# EasyEDA Pro project can2clusterV2.epro

# Schematic can2clusterV3
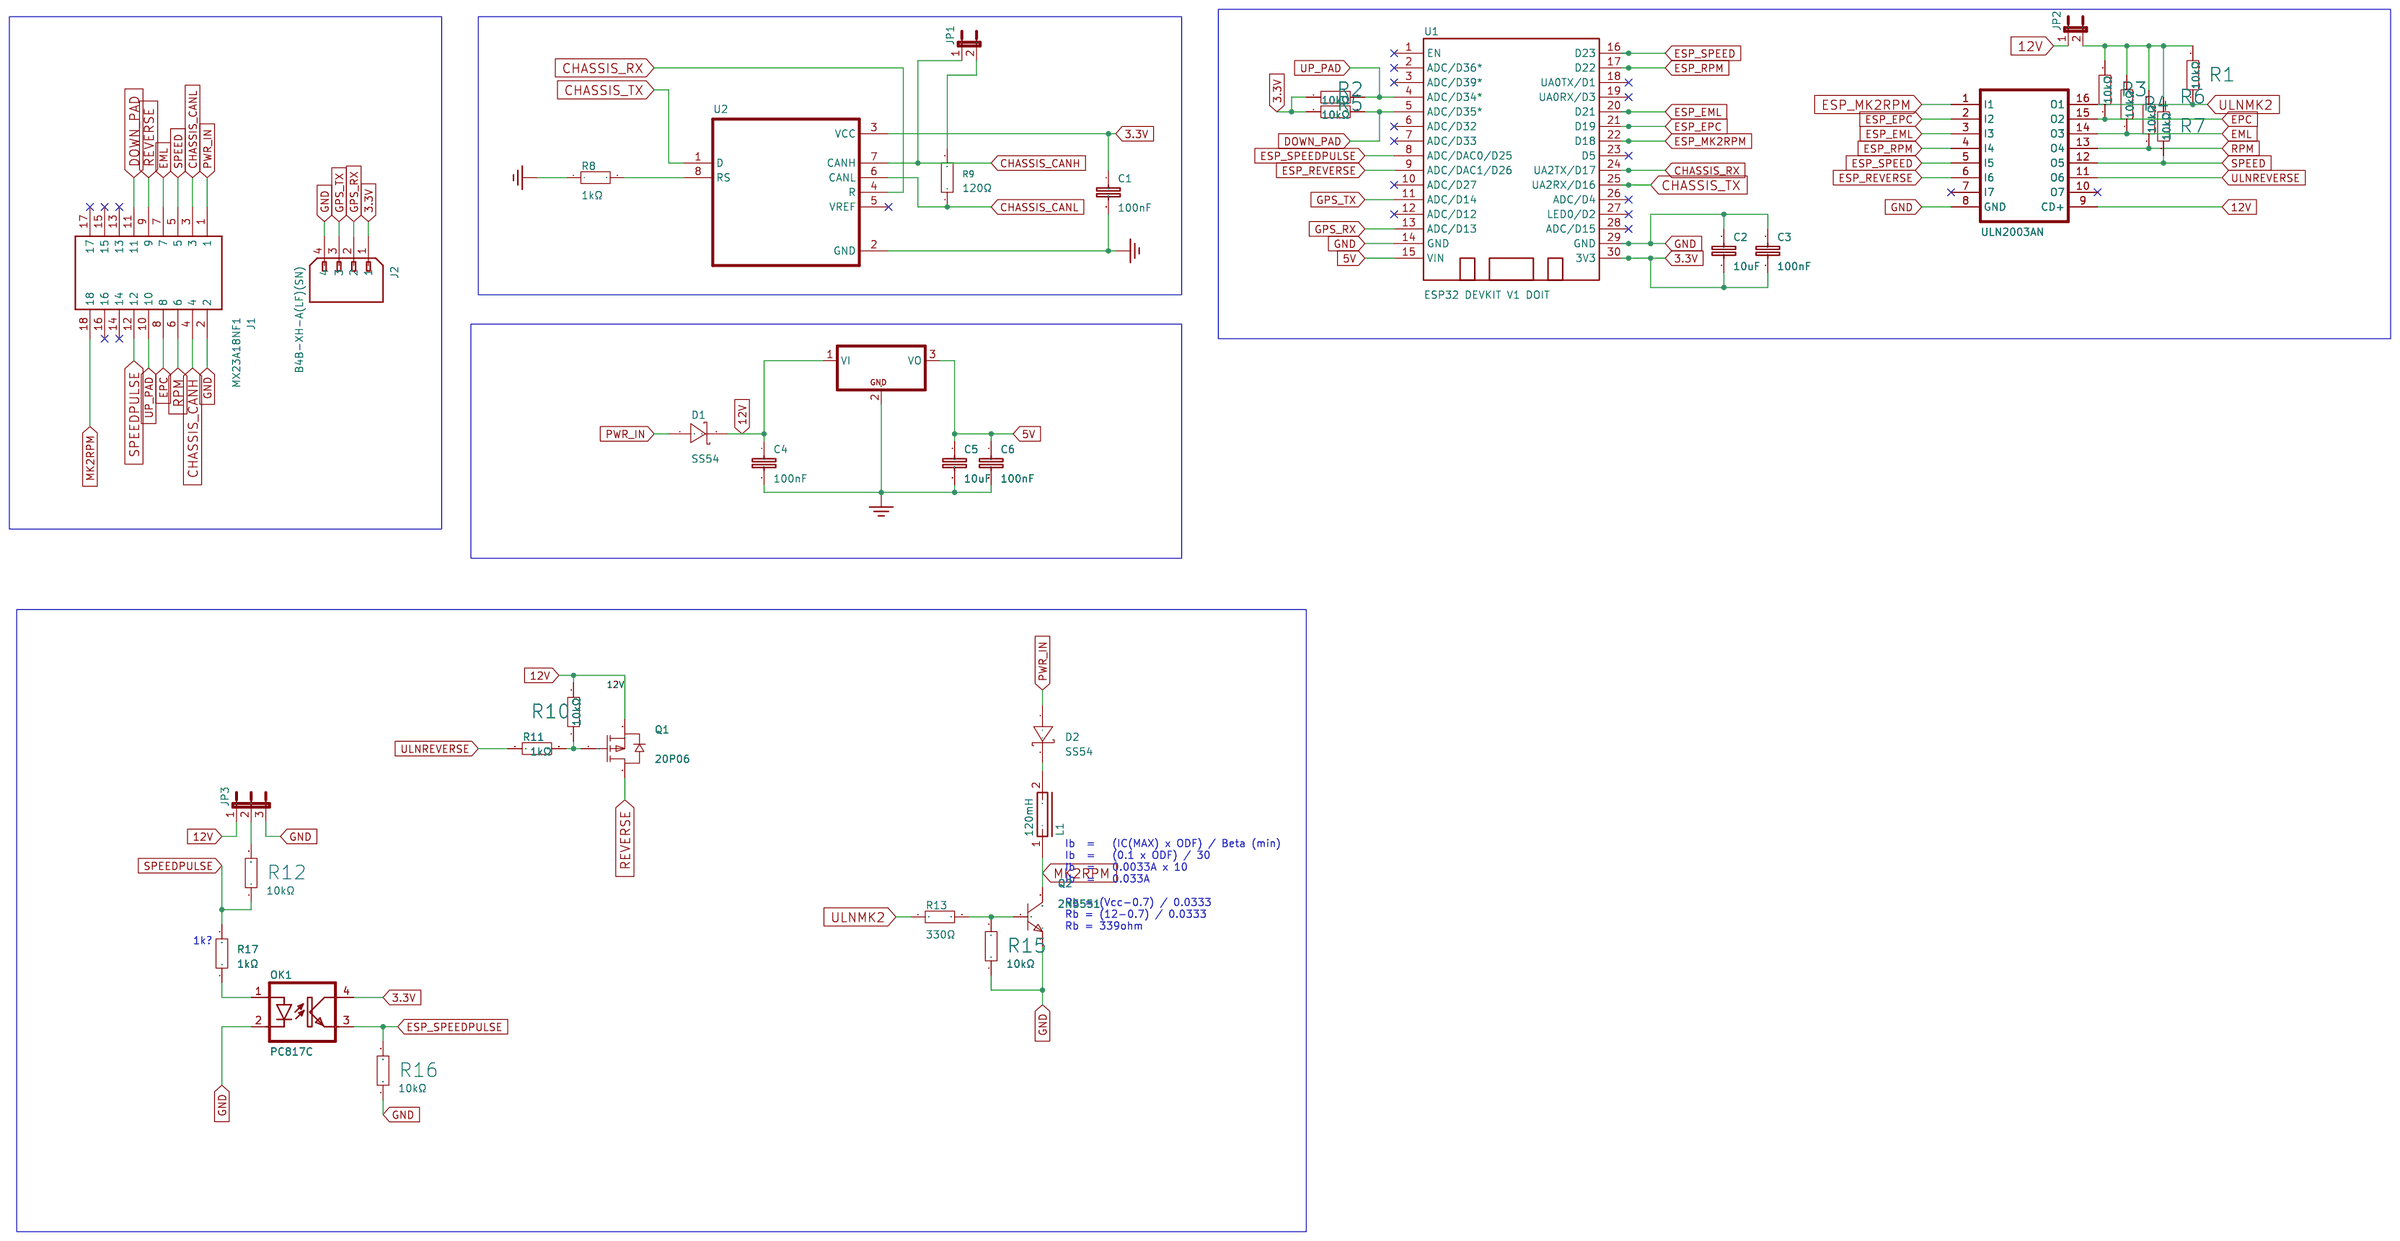
[diagram p0: schematic sheet]

## Parts
C1  100nF  [C0603]
C2  10uF  [C0805]
C3  100nF  [C0603]
C4  100nF  [C0603]
C5  10uF  [C0805]
C6  100nF  [C0603]
D1  SS54  [SMA_L4.4-W2.8-LS5.4-R-RD]
D2  SS54  [SMA_L4.4-W2.8-LS5.4-R-RD]
IC1  ULN2003AN  [DIP-16_L19.7-W6.6-P2.54-LS7.6-BL]
IC2  L7805ABD2T-TR  [TO-263-2_L10.0-W9.2-P5.08-LS15.3-TL-CW]
J1  MX23A18NF1  [CONN-TH_18P-P2.50_MX23A18NF1]
J2  B4B-XH-A(LF)(SN)  [CONN-TH_B4B-XH-A-LF-SN]
JP1  PZ254V-11-02P  [HDR-TH_2P-P2.54-V-M]
JP2  PZ254V-11-02P  [HDR-TH_2P-P2.54-V-M]
JP3  PZ254V-11-03P  [HDR-TH_3P-P2.54-V-M]
L1  120mH  [IND-SMD_L12.5-W12.5]
OK1  PC817C  [OPTO-SMD-4_L4.6-W6.5-P2.54-LS10.3-TL]
Q1  20P06  [TO-252-2_L6.6-W6.1-P4.57-LS9.9-BR-CW]
Q2  2N5551  [SOT-23-3_L2.9-W1.4-P1.90-LS2.5-BR]
R1  10kΩ  [R0603]
R2  10kΩ  [R0603]
R3  10kΩ  [R0603]
R4  10kΩ  [R0603]
R5  10kΩ  [R0603]
R6  10kΩ  [R0603]
R7  10kΩ  [R0603]
R8  1kΩ  [R0603]
R9  120Ω  [R0603]
R10  10kΩ  [R0603]
R11  1kΩ  [R0603]
R12  10kΩ  [R0603]
R13  330Ω  [R0603]
R15  10kΩ  [R0603]
R16  10kΩ  [R0603]
R17  1kΩ  [R0603]
U1  ESP32 DEVKIT V1 DOIT  [DOIT-ESP32-DEVKIT-V1]
U2  SN65HVD230DR  [SOIC-8_L4.9-W3.9-P1.27-LS6.0-BL]

## Library data of the parts
C1 C3 C4 C6 = CC0603KRX7R9BB104: Capacitance:100nF Tolerance:±10% Tolerance:±10% Voltage Rating:50V Temperature Coefficient:X7R; LCSC Part Name: 100nF ±10% 50V; Supplier Part: C14663; Manufacturer: YAGEO(国巨); Supplier Footprint: 0603; JLCPCB Part Class: Basic Part; Datasheet: https://atta.szlcsc.com/upload/public/pdf/source/20250214/096C4C206003071F5D32E5F0D8E7F8DF.pdf; Supplier: LCSC; Tolerance: ±10%; Voltage Rating: 50V; Temperature Coefficient: X7R
C2 C5 = CL21A106KAYNNNE_C15850: Capacitance: Tolerance:±10% Tolerance:±10% Voltage Rated: Temperature Coefficient:; LCSC Part Name: 10uF ±10% 25V; Supplier Part: C15850; Manufacturer: SAMSUNG(三星); Manufacturer Part: CL21A106KAYNNNE; Supplier Footprint: 0805; JLCPCB Part Class: Basic Part; Datasheet: https://atta.szlcsc.com/upload/public/pdf/source/20160218/1457707763339.pdf; Supplier: LCSC; Tolerance: ±10%
D1 D2 = SS54_C22452: Diode Configuration:Independent Type Forward Voltage (Vf@If):550mV@5A Reverse Voltage (Vr):40V Rectified Current:5A Reverse Leakage Current (Ir):1mA@40V; LCSC Part Name: 电压:40V 电流:5A; Supplier Part: C22452; Manufacturer: MDD(辰达半导体); Supplier Footprint: SMA(DO-214AC); JLCPCB Part Class: Basic Part; Datasheet: https://atta.szlcsc.com/upload/public/pdf/source/20240710/73DFBB65C1883B895E62D589679033DF.pdf; Supplier: LCSC; Diode Configuration: Independent Type; Forward Voltage (Vf@If): 550mV@5A; Reverse Voltage (Vr): 40V; Rectified Current: 5A; Reverse Leakage Current (Ir): 1mA@40V
IC1 = ULN2003AN_C7432319: Supplier Part: C7432319; Manufacturer: HGSEMI(华冠); Supplier Footprint: DIP-16; JLCPCB Part Class: Extended Part; Datasheet: https://atta.szlcsc.com/upload/public/pdf/source/20230912/E2292EB18F082A67756D9BB26BF00C82.pdf; Supplier: LCSC
IC2 = L7805ABD2T-TR: Output Type:Fixed Maximum Input Voltage:35V Output Voltage:5V Output Voltage:5V Output Current:1.5A Power Supply Rejection Ratio (PSRR):68dB@(120Hz) Dropout Voltage:2V@(1A) standby current:6mA Feature:Short-Circuit  Protection；Thermal Protection(TSD) Oper; LCSC Part Name: 正稳压器IC; Supplier Part: C86206; Manufacturer: ST(意法半导体); Supplier Footprint: TO-263-2; JLCPCB Part Class: Extended Part; Datasheet: https://atta.szlcsc.com/upload/public/pdf/source/20191219/C472632_C0855675BBC73B8C8E44EE1325AAD56A.pdf; Supplier: LCSC; Output Type: Fixed; Maximum Input Voltage: 35V; Output Voltage: 5V; Output Current: 1.5A; Power Supply Rejection Ratio (PSRR): 68dB@(120Hz); Dropout Voltage: 2V@(1A); standby current: 6mA; Feature: Short-Circuit  Protection；Thermal Protection(TSD); Operating Temperature: -40℃~+125℃; Output Polarity: Positive electrode; Number of Outputs: 1
J1 = MX23A18NF1: Supplier Part: C2977290; Manufacturer: JAE(日本航空电子); JLCPCB Part Class: Extended Part; Supplier: LCSC
J2 = B4B-XH-A(LF)(SN): Pins Structure:1x4P Pitch:2.5mm Mounting Style:Direct Insert Reference Series:XH Number of Pins:4P Number of Rows:1 Number of PINs Per Row:4 Row Spacing:- Current Rating (Max):3A Contact Material:Brass Contact Plating:Tin Operating Temperature Range:-25℃~; LCSC Part Name: 1x4P 间距:2.5mm 直插 系列:XH; Supplier Part: C144395; Manufacturer: JST; Supplier Footprint: 插件,P=2.5mm; JLCPCB Part Class: Extended Part; Datasheet: https://atta.szlcsc.com/upload/public/pdf/source/20180928/C265283_F9DFEEBDB2CF642B6BDFAB4B77BD2680.pdf; Supplier: LCSC; Pins Structure: 1x4P; Pitch: 2.5mm; Mounting Style: Direct Insert; Reference Series: XH; Number of Pins: 4P; Number of Rows: 1; Number of PINs Per Row: 4; Current Rating (Max): 3A; Contact Material: Brass; Contact Plating: Tin; Operating Temperature Range: -25℃~+85℃; Rated Voltage (Max): 250V; Plastic Material: PA66; Flame Retardant Rating: UL94V-0; Supplementary Features: K-leg punch; Colour: White; Z-Height of the Board: 7mm; X-Length of Bottom Edge on Board (Spacing Line): 12.4mm; Y-Width of Bottom Edge on Board: 5.75mm
JP1 JP2 = PZ254V-11-02P: Pin Structure:1x2P Pitch:2.54mm Row Spacing:- Circluar Pins/Square Pins:Policy Mounting Type:Straight Number of Rows:Single Row Number of Pins:2P Current Rating:- Voltage Rating (Max):- Length of Mating Pin:6mm Insulation Height:2.5mm Length of End Connec; LCSC Part Name: 1x2P 间距:2.54mm 方针 直插; Supplier Part: C492401; Manufacturer: XFCN(兴飞); Supplier Footprint: 插件,P=2.54mm; JLCPCB Part Class: Extended Part; Datasheet: https://atta.szlcsc.com/upload/public/pdf/source/20200309/C492401_A812433581A9B211A7FFA413ADDFF0E5.pdf; Supplier: LCSC; Pin Structure: 1x2P; Pitch: 2.54mm; Circluar Pins/Square Pins: Policy; Mounting Type: Straight; Number of Rows: Single Row; Number of Pins: 2P; Length of Mating Pin: 6mm; Insulation Height: 2.5mm; Length of End Connection Pin: 3mm; Contact Material: Brass; Operating Temperature: -40℃~+105℃; Color: Black
JP3 = PZ254V-11-03P: Pin Structure:1x3P Pitch:2.54mm Row Spacing:- Circluar Pins/Square Pins:Policy Mounting Type:Straight Number of Rows:Single Row Number of Pins:3P Current Rating:3A Voltage Rating (Max):250V Length of Mating Pin:6mm Insulation Height:2.5mm Length of End Co; LCSC Part Name: 1x3P 间距:2.54mm 方针 直插; Supplier Part: C2937625; Manufacturer: XFCN(兴飞); Supplier Footprint: 插件,P=2.54mm; JLCPCB Part Class: Extended Part; Datasheet: https://atta.szlcsc.com/upload/public/pdf/source/20200309/C492402_8335C3D49C4E4C618838D59BB1D024C1.pdf; Supplier: LCSC; Pin Structure: 1x3P; Pitch: 2.54mm; Circluar Pins/Square Pins: Policy; Mounting Type: Straight; Number of Rows: Single Row; Number of Pins: 3P; Current Rating: 3A; Voltage Rating (Max): 250V; Length of Mating Pin: 6mm; Insulation Height: 2.5mm; Length of End Connection Pin: 3mm; Operating Temperature: -40℃~+105℃; Color: Black
L1 = DR125-124-R: Inductance:120mH Tolerance:±20% Tolerance:±20% Current Rating:60mA Current - Saturation(Isat):69mA DC Resistance(DCR):150Ω Type:- Ratings:-; LCSC Part Name: 120mH ±20% 69mA; Supplier Part: C2453120; Manufacturer: EATON(伊顿); Supplier Footprint: SMD,12.5x12.5mm; JLCPCB Part Class: Extended Part; Datasheet: https://atta.szlcsc.com/upload/public/pdf/source/20210417/1890D5F29C45E96B4D8E6D27BBAB5A55.pdf; Supplier: LCSC; Tolerance: ±20%; Current Rating: 60mA; Current - Saturation(Isat): 69mA; DC Resistance(DCR): 150Ω
OK1 = PC817C_C3025164: Input voltage type:DC Output Type:Phototransistor Voltage - Forward(Vf):1.2V Output Current:50mA Isolation Voltage(Vrms):5kV Reverse Voltage:6V Load Voltage:35V Number of Outputs:1 Vce Saturation(VCE(sat)):100mV@1mA,20mA Rise time:6us@2mA,100Ω Fall time:5; LCSC Part Name: C档 PC817C C档; Supplier Part: C3025164; Manufacturer: GOODWORK(固得沃克); Supplier Footprint: SMD-4P; JLCPCB Part Class: Extended Part; Datasheet: https://atta.szlcsc.com/upload/public/pdf/source/20240617/7F1B42AFA4D9649DF13B74B1E0B1F256.pdf; Supplier: LCSC; Input voltage type: DC; Output Type: Phototransistor; Voltage - Forward(Vf): 1.2V; Output Current: 50mA; Isolation Voltage(Vrms): 5kV; Reverse Voltage: 6V; Load Voltage: 35V; Number of Outputs: 1; Vce Saturation(VCE(sat)): 100mV@1mA,20mA; Rise time: 6us@2mA,100Ω; Fall time: 5us@2mA,100Ω; Operating Temperature: -55℃~+110℃; Current Transfer Ratio (CTR) Minimum: 200%; Current Transfer Ratio (CTR) Maximum/Saturation Value: 400%
Q1 = 20P06: Type:1 Piece P-Channel Drain Source Voltage (Vdss):60V Continuous Drain Current (Id): Drain Source On Resistance (RDS(on)@Vgs,Id):48mΩ Gate Threshold Voltage (Vgs(th)@Id):2.5V; LCSC Part Name: 1个P沟道 耐压:60V 电流:20A; Supplier Part: C18164394; Manufacturer: HL(富海微); Supplier Footprint: TO-252; JLCPCB Part Class: Extended Part; Datasheet: https://atta.szlcsc.com/upload/public/pdf/source/20231012/DDB4F5E9C77D3DD288E1321309E3ABAC.pdf; Supplier: LCSC; Type: 1 Piece P-Channel; Drain Source Voltage (Vdss): 60V; Drain Source On Resistance (RDS(on)@Vgs,Id): 48mΩ; Gate Threshold Voltage (Vgs(th)@Id): 2.5V
Q2 = 2N5551_C7529570: Transistor Type: Collector Current (Ic): Collector-Emitter Breakdown Voltage (Vceo): Power Dissipation (Pd):625mW DC Current Gain (hFE@Ic,Vce):80@10mA,5V DC Current Gain (hFE@Ic,Vce):80@10mA,5V Transition Frequency (fT):80MHz Collector Cut-Off Current (Ic; LCSC Part Name: NPN 电流:1A 耐压:160V; Supplier Part: C7529570; Manufacturer: RUILON(瑞隆源); Supplier Footprint: SOT-23; JLCPCB Part Class: Extended Part; Datasheet: https://atta.szlcsc.com/upload/public/pdf/source/20231206/D621ADD1802AEB70BE68282CC20D67DB.pdf; Supplier: LCSC; Power Dissipation (Pd): 625mW; DC Current Gain (hFE@Ic,Vce): 80@10mA,5V; Transition Frequency (fT): 80MHz; Collector Cut-Off Current (Icbo): 100nA; Collector-Emitter Saturation Voltage (VCE(sat)@Ic,Ib): 500mV@50mA,5mA; Operating Temperature: -55℃~+150℃
R1-R7 R10 R12 R15 R16 = 0603WAF1002T5E: Type:Thick Film Resistor Resistance:10kΩ Tolerance:±1% Tolerance:±1% Power(Watts):100mW Voltage-Supply(Max):75V Temperature Coefficient:±100ppm/℃ Temperature Coefficient:±100ppm/℃ Operating Temperature:-55℃~+155℃ Operating Temperature:-55℃~+155℃; LCSC Part Name: 厚膜电阻 10kΩ ±1% 100mW; Supplier Part: C25804; Manufacturer: UNI-ROYAL(厚声); Supplier Footprint: 0603; JLCPCB Part Class: Basic Part; Datasheet: https://atta.szlcsc.com/upload/public/pdf/source/20200306/C422600_1E6D84923E4A46A82E41ADD87F860B5C.pdf; Supplier: LCSC; Type: Thick Film Resistor; Tolerance: ±1%; Power(Watts): 100mW; Voltage-Supply(Max): 75V; Temperature Coefficient: ±100ppm/℃; Operating Temperature: -55℃~+155℃
R8 R11 R17 = 0603WAF1001T5E: Type:Thick Film Resistors Resistance:1kΩ Tolerance:±1% Tolerance:±1% Power(Watts): Overload Voltage (Max): Temperature Coefficient:±100ppm/℃ Temperature Coefficient:±100ppm/℃ Operating Temperature Range:-55℃~+155℃ Operating Temperature Range:-55℃~+155℃; LCSC Part Name: 1kΩ ±1% 100mW 厚膜电阻; Supplier Part: C21190; Manufacturer: UNI-ROYAL(厚声); Supplier Footprint: 0603; JLCPCB Part Class: Basic Part; Datasheet: https://atta.szlcsc.com/upload/public/pdf/source/20200306/C422600_1E6D84923E4A46A82E41ADD87F860B5C.pdf; Supplier: LCSC; Type: Thick Film Resistors; Tolerance: ±1%; Temperature Coefficient: ±100ppm/℃; Operating Temperature Range: -55℃~+155℃
R9 = 0603WAF1200T5E: Type:Thick Film Resistors Resistance: Tolerance:±1% Tolerance:±1% Power(Watts): Overload Voltage (Max): Temperature Coefficient:±100ppm/℃ Temperature Coefficient:±100ppm/℃ Operating Temperature Range:-55℃~+155℃ Operating Temperature Range:-55℃~+155℃; LCSC Part Name: 120Ω ±1% 100mW 厚膜电阻; Supplier Part: C22787; Manufacturer: UNI-ROYAL(厚声); Supplier Footprint: 0603; JLCPCB Part Class: Basic Part; Datasheet: https://atta.szlcsc.com/upload/public/pdf/source/20200306/C422600_1E6D84923E4A46A82E41ADD87F860B5C.pdf; Supplier: LCSC; Type: Thick Film Resistors; Tolerance: ±1%; Temperature Coefficient: ±100ppm/℃; Operating Temperature Range: -55℃~+155℃
R13 = 0603WAF3300T5E: Type:Thick Film Resistors Resistance: Tolerance:±1% Tolerance:±1% Power(Watts): Overload Voltage (Max): Temperature Coefficient:±100ppm/℃ Temperature Coefficient:±100ppm/℃ Operating Temperature Range:-55℃~+155℃ Operating Temperature Range:-55℃~+155℃; LCSC Part Name: 330Ω ±1% 100mW 厚膜电阻; Supplier Part: C23138; Manufacturer: UNI-ROYAL(厚声); Supplier Footprint: 0603; JLCPCB Part Class: Basic Part; Datasheet: https://atta.szlcsc.com/upload/public/pdf/source/20200306/C422600_1E6D84923E4A46A82E41ADD87F860B5C.pdf; Supplier: LCSC; Type: Thick Film Resistors; Tolerance: ±1%; Temperature Coefficient: ±100ppm/℃; Operating Temperature Range: -55℃~+155℃
U1 = ESP32 DEVKIT V1 DOIT
U2 = SN65HVD230DR: Type:CANtransceiver Data Rate:1Mbps Voltage - Supply:- Voltage - Supply:- Current - Supply:- Operating Temperature:-40℃~+85℃ Operating Temperature:-40℃~+85℃; LCSC Part Name: 3.3-V CAN 收发器; Supplier Part: C12084; Manufacturer: TI(德州仪器); Supplier Footprint: SOIC-8; JLCPCB Part Class: Extended Part; Datasheet: https://www.ti.com/cn/lit/gpn/sn65hvd230; Supplier: LCSC; Type: CANtransceiver; Data Rate: 1Mbps; Operating Temperature: -40℃~+85℃

## Nets
3.3V: C1.1 C2.2 C3.2 J2.1 OK1.4(COL) R2.1 R5.1 U1.30(3V3) U2.3(VCC)
5V: C5.1 C6.1 IC2.3(VO) U1.15(VIN)
12V: C4.1 D1.2(K) IC1.9(CD+) IC2.1(VI) JP2.1 JP3.1 Q1.3(S) R10.2
GND: C1.2 C2.1 C3.1 C4.2 C5.2 C6.2 IC1.8(GND) IC2.2(GND) J1.2 J2.4 JP3.3 OK1.2(C) Q2.2(E) R8.1 R15.1 R16.1 U1.14(GND) U1.29(GND) U2.2(GND)
CHASSIS_CANH: J1.4 JP1.1 U2.7(CANH)
CHASSIS_CANL: J1.3 R9.1 U2.6(CANL)
CHASSIS_RX: U1.24(UA2TX/D17) U2.4(R)
CHASSIS_TX: U1.25(UA2RX/D16) U2.1(D)
DOWN_PAD: J1.11 R5.2 U1.5(ADC/D35*)
EML: IC1.14(O3) J1.7 R4.1
EPC: IC1.15(O2) J1.8 R3.1
ESP_EML: IC1.3(I3) U1.20(D21)
ESP_EPC: IC1.2(I2) U1.21(D19)
ESP_MK2RPM: IC1.1(I1) U1.22(D18)
ESP_REVERSE: IC1.6(I6) U1.9(ADC/DAC1/D26)
ESP_RPM: IC1.4(I4) U1.17(D22)
ESP_SPEED: IC1.5(I5) U1.16(D23)
ESP_SPEEDPULSE: OK1.3(EMIT) R16.2 U1.8(ADC/DAC0/D25)
GPS_RX: J2.2 U1.13(ADC/D13)
GPS_TX: J2.3 U1.11(ADC/D14)
MK2RPM: J1.18 L1.1 Q2.3(C)
N$1: D2.2(K) L1.2
N$5: R8.2 U2.8(RS)
N$8: JP1.2 R9.2
N$13: OK1.1(A) R17.1
N$14: JP3.2 R12.2
PWR_IN: D1.1(A) D2.1(A) J1.1
REVERSE: J1.9 Q1.2(D)
RPM: IC1.13(O4) J1.6 R6.1
SPEED: IC1.12(O5) J1.5 R7.1
SPEEDPULSE: J1.12 R12.1 R17.2
ULNMK2: IC1.16(O1) R1.1 R13.1
ULNREVERSE: IC1.11(O6) R11.1
UP_PAD: J1.10 R2.2 U1.4(ADC/D34*)
$1N6167: Q2.1(B) R13.2 R15.2
$1N7551: Q1.1(G) R10.1 R11.2
Net-(JP2-2): JP2.2 R1.2 R3.2 R4.2 R6.2 R7.2

Not connected (* = marked no-connect by the designer): IC1 7(I7)* 10(O7)*; J1 13* 14* 15* 16* 17*; U1 1(EN)* 2(ADC/D36*)* 3(ADC/D39*)* 6(ADC/D32)* 7(ADC/D33)* 10(ADC/D27)* 12(ADC/D12)* 18(UA0TX/D1)* 19(UA0RX/D3)* 23(D5)* 26(ADC/D4)* 27(LED0/D2)* 28(ADC/D15)*; U2 5(VREF)*

## Notes on the sheet
- Ib  =   (IC(MAX) x ODF) / Beta (min)
  Ib  =   (0.1 x ODF) / 30
  Ib  =   0.0033A x 10
  Ib  =   0.033A
  Rb = (Vcc-0.7) / 0.0333
  Rb = (12-0.7) / 0.0333
  Rb = 339ohm
- 1k?

# Board can2clusterV3
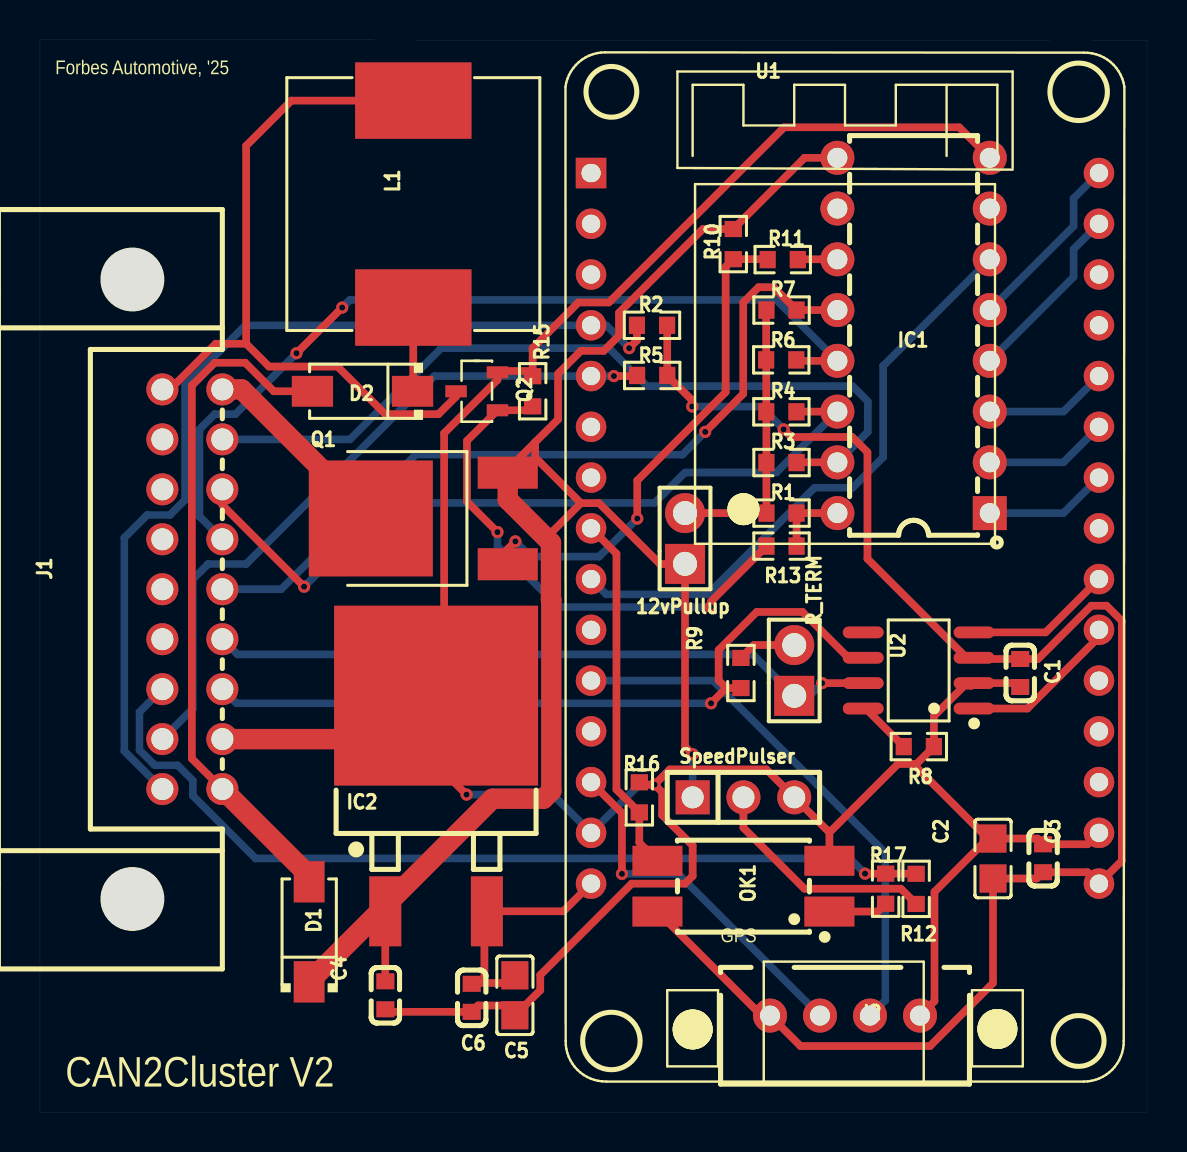
[diagram p1: board, top side]
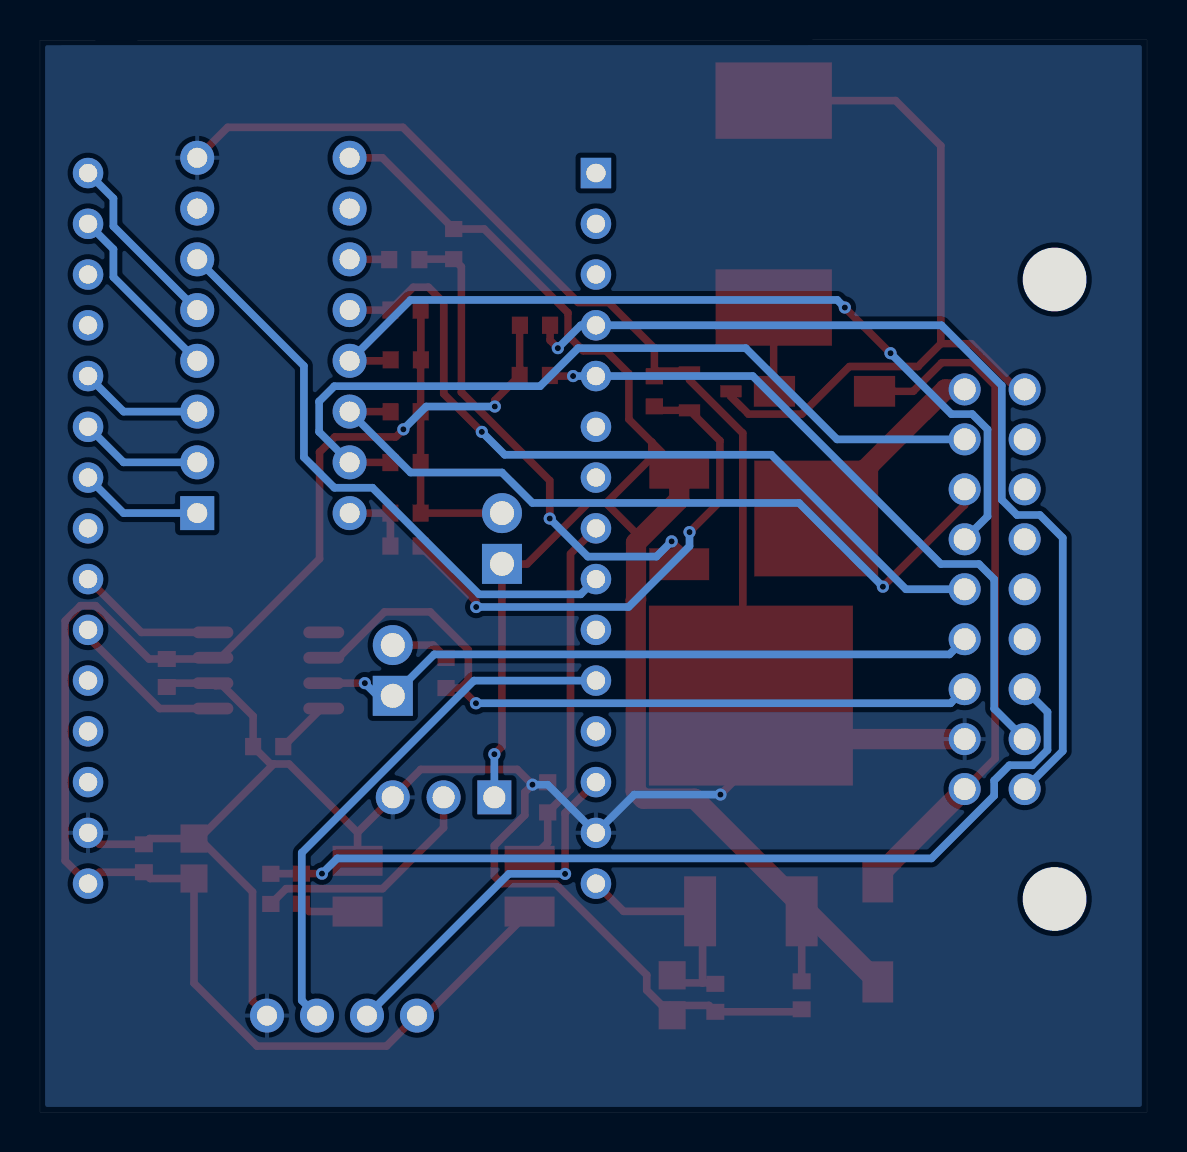
[diagram p2: board, bottom side, seen from below]

Outline 55.36 x 53.65 mm; copper layers: Top Layer, Bottom Layer. Coordinates in mm from the lower left corner of the outline.
Outline path: 0,53.65 0,0 55.36,0 55.36,53.64 0,53.65
Stack: Top Layer 0.035mm / Dielectric1 1.51mm FR4 er 4.5 / Bottom Layer 0.035mm

## Design rules (mm)
net CHASSIS_CANH: DP1
net CHASSIS_TX: DP2
net CHASSIS_CANL: DP1
net CHASSIS_RX: DP2
template: Custom Config
spacing copperThickness1oz (default): track to track 0.102, other pairs 0.152 to 0.3
spacing copperThickness2oz: track to track 0.203, other pairs 0.152 to 0.3
track width copperThickness1oz (default): min 0.203, default 0.381, max 2.54
track width copperThickness2oz: min 0.203, default 0.254, max 2.54
differential pair differentialPair (default): width min 0.127, default 0.254, max 2.54; gap min 0.152, default 0.152
via viaSize (default): diameter min 0.5, default 0.61, max 10; hole min 0.3, default 0.305, max 6.299
net 12V uses copperThickness2oz
net PWR_IN uses copperThickness2oz
net REVERSE uses copperThickness2oz

## Placement (name value [footprint] x y rotation side)
12vPullup  PZ254V-11-02P  [HDR-TH_2P-P2.54-V-M]  32.26 28.7 90 top
C1  100nF  [C0603]  49.02 21.97 270 top
C2  10uF  [C0805]  47.66 12.69 270 top
C3  100nF  [C0603]  50.16 12.7 270 top
C4  100nF  [C0603]  17.27 5.84 270 top
C5  10uF  [C0805]  23.75 5.84 270 top
C6  100nF  [C0603]  21.59 5.72 270 top
D1  SS54  [SMA_L4.4-W2.8-LS5.4-R-RD]  13.46 9.02 90 top
D2  SS54  [SMA_L4.4-W2.8-LS5.4-R-RD]  16.13 36.07 180 top
IC1  ULN2003AN  [DIP-16_L19.7-W6.6-P2.54-LS7.6-BL]  43.69 38.86 90 top
IC2  L7805ABD2T-TR  [TO-263-2_L10.0-W9.2-P5.08-LS15.3-TL-CW]  19.81 15.44 90 top
J1  MX23A18NF1  [CONN-TH_18P-P2.50_MX23A18NF1]  7.62 26.16 270 top
J2  B4B-XH-A(LF)(SN)  [CONN-TH_B4B-XH-A-LF-SN]  40.26 4.83 180 top
L1  120mH  [IND-SMD_L12.5-W12.5]  18.67 45.44 90 top
OK1  PC817C  [OPTO-SMD-4_L4.6-W6.5-P2.54-LS10.3-TL]  35.18 11.3 180 top
Q1  20P06  [TO-252-2_L6.6-W6.1-P4.57-LS9.9-BR-CW]  19.97 29.7 0 top
Q2  2N5551  [SOT-23-3_L2.9-W1.4-P1.90-LS2.5-BR]  21.84 36.07 0 top
R1  10kΩ  [R0603]  37.08 29.97 180 top
R2  10kΩ  [R0603]  30.61 39.37 180 top
R3  10kΩ  [R0603]  37.08 32.5 180 top
R4  10kΩ  [R0603]  37.08 35.04 180 top
R5  10kΩ  [R0603]  30.62 36.86 180 top
R6  10kΩ  [R0603]  37.07 37.64 180 top
R7  10kΩ  [R0603]  37.08 40.13 180 top
R8  1kΩ  [R0603]  43.95 18.29 180 top
R9  120Ω  [R0603]  35.05 21.97 90 top
R10  10kΩ  [R0603]  34.67 43.43 90 top
R11  1kΩ  [R0603]  37.14 42.66 180 top
R12  10kΩ  [R0603]  43.81 11.17 270 top
R13  330Ω  [R0603]  37.08 28.32 180 top
R15  10kΩ  [R0603]  24.64 36.07 270 top
R16  10kΩ  [R0603]  29.97 15.75 270 top
R17  1kΩ  [R0603]  42.29 11.18 90 top
R_TERM  PZ254V-11-02P  [HDR-TH_2P-P2.54-V-M]  37.72 22.1 90 top
SpeedPulser  PZ254V-11-03P  [HDR-TH_3P-P2.54-V-M]  35.18 15.75 0 top
U1  ESP32 DEVKIT V1 DOIT  [DOIT-ESP32-DEVKIT-V1]  27.56 46.99 0 top
U2  SN65HVD230DR  [SOIC-8_L4.9-W3.9-P1.27-LS6.0-BL]  43.94 22.1 90 top

## Footprints (pads in the part's own frame, mm; a bottom-side part is the same pattern mirrored in y, then rotated)
C0603
  rect 0.8x0.9 smd: 1(-0.7,0) 2(0.7,0)
C0805
  rect 1.41x1.35 smd: 1(-1,0) 2(1,0)
CONN-TH_18P-P2.50_MX23A18NF1
  round 1.6 hole 1.1: 1(10,1.5) 2(7.5,1.5) 3(5,1.5) 4(2.5,1.5) 5(0,1.5) 6(-2.5,1.5) 7(-5,1.5) 8(-7.5,1.5) 9(-10,1.5) 10(10,-1.5) 11(7.5,-1.5) 12(5,-1.5) 13(2.5,-1.5) 14(0,-1.5) 15(-2.5,-1.5) 16(-5,-1.5) 17(-7.5,-1.5) 18(-10,-1.5)
CONN-TH_B4B-XH-A-LF-SN
  round 1.7 hole 1: 1(3.75,0) 2(1.25,0) 3(-1.25,0) 4(-3.75,0)
DIP-16_L19.7-W6.6-P2.54-LS7.6-BL
  rect 1.7x1.7 hole 1: 1(-8.89,-3.81)
  round 1.7 hole 1: 2(-6.35,-3.81) 3(-3.81,-3.81) 4(-1.27,-3.81) 5(1.27,-3.81) 6(3.81,-3.81) 7(6.35,-3.81) 8(8.89,-3.81) 9(8.89,3.81) 10(6.35,3.81) 11(3.81,3.81) 12(1.27,3.81) 13(-1.27,3.81) 14(-3.81,3.81) 15(-6.35,3.81) 16(-8.89,3.81)
DOIT-ESP32-DEVKIT-V1
  rect 1.524x1.524 hole 0.96x0.914: 1(0,0)
  round 1.524 hole 0.914: 2(0,-2.54) 3(0,-5.08) 4(0,-7.62) 5(0,-10.16) 6(0,-12.7) 7(0,-15.24) 8(0,-17.78) 9(0,-20.32) 10(0,-22.86) 11(0,-25.4) 12(0,-27.94) 13(0,-30.48) 14(0,-33.02) 15(0,-35.56) 16(25.4,0) 17(25.4,-2.54) 18(25.4,-5.08) 19(25.4,-7.62) 20(25.4,-10.16) 21(25.4,-12.7) 22(25.4,-15.24) 23(25.4,-17.78) 24(25.4,-20.32) 25(25.4,-22.86) 26(25.4,-25.4) 27(25.4,-27.94) 28(25.4,-30.48) 29(25.4,-33.02) 30(25.4,-35.56)
HDR-TH_2P-P2.54-V-M
  rect 2x2 hole 1.2: 1(-1.27,0)
  round 2 hole 1.2: 2(1.27,0)
HDR-TH_3P-P2.54-V-M
  rect 1.7x1.7 hole 1.1: 1(-2.54,0)
  round 1.7 hole 1.1: 2(0,0) 3(2.54,0)
IND-SMD_L12.5-W12.5
  rect 3.824x5.82 smd: 1(5.178,0) 2(-5.178,0)
OPTO-SMD-4_L4.6-W6.5-P2.54-LS10.3-TL
  rect 2.5x1.5 smd: 1(-4.3,1.27) 2(-4.3,-1.27) 3(4.3,-1.27) 4(4.3,1.27)
R0603
  rect 0.806x0.864 smd: 1(-0.753,0) 2(0.753,0)
SMA_L4.4-W2.8-LS5.4-R-RD
  rect 2.062x1.539 smd: 1(2.503,0) 2(-2.503,0)
SOIC-8_L4.9-W3.9-P1.27-LS6.0-BL
  oval 0.588x2.045 smd: 1(-1.905,-2.772) 2(-0.635,-2.772) 3(0.635,-2.772) 4(1.905,-2.772) 5(1.905,2.772) 6(0.635,2.772) 7(-0.635,2.772) 8(-1.905,2.772)
SOT-23-3_L2.9-W1.4-P1.90-LS2.5-BR
  rect 1.07x0.6 smd: 1(1.035,-0.95) 2(1.035,0.95) 3(-1.035,0)
TO-252-2_L6.6-W6.1-P4.57-LS9.9-BR-CW
  rect 3x1.6 smd: 1(3.424,-2.29) 3(3.424,2.29)
  rect 6.2x5.8 smd: 2(-3.424,0)
TO-263-2_L10.0-W9.2-P5.08-LS15.3-TL-CW
  rect 3.5x1.6 smd: 1(-5.397,2.54) 3(-5.397,-2.54)
  rect 9x10.2 smd: 2(5.397,0)

## Nets
As in the schematic, except:
12V: 12vPullup.1 C4.1 D1.2 IC1.9 IC2.1 Q1.3 R10.2 SpeedPulser.1
GND: C1.2 C2.1 C3.1 C4.2 C5.2 C6.2 IC1.8 IC2.2 J1.2 J2.4 OK1.2 Q2.2 R8.1 R15.1 R16.1 SpeedPulser.3 U1.14 U1.29 U2.2
CHASSIS_CANH: J1.4 R_TERM.1 U2.7
N$8: R9.2 R_TERM.2
N$14: R12.2 SpeedPulser.2
$1N9668: 12vPullup.2 R1.2 R3.2 R4.2 R6.2 R7.2

Pads without a net: IC1 7 10; J1 13 14 15 16 17; U1 1 2 3 6 7 10 12 18 19 23 26 27 28; U2 5

## Via types
v1: diameter 0.61, hole 0.305, Top Layer to Bottom Layer, 19 vias

## Routing (per net, layer and track width the routed paths; a pad name or vN(x,y) marks a point on that pad's centre or on a via; arc(x,y) is an arc through that point)
3.3V: length 81.2
  Top Layer w0.381: v1(32.62,35.31) 32.62,35.61 R5.1 31.37,39.36 R2.1 ; v1(37.19,34.16) 37.57,33.78 40.62,33.78 41.38,33.02 41.38,27.69 46.33,22.73 U2.3 46.78,22.67 C1.1 49.91,22.67 52.58,25.34 53.34,25.34 54.1,24.58 54.1,12.57 U1.30 52.39,12 C3.2 49.85,11.69 C2.2 47.66,6.45 44.51,3.3 38.03,3.3 J2.1 36.09,4.83 OK1.4
  Bottom Layer w0.381: v1(32.62,35.31) 36.05,35.31 v1(37.19,34.16)
5V: length 11.8
  Top Layer w0.381: 22.22,6.46 22.22,9.92 IC2.3 26.17,10.04 U1.15 ; 22.22,6.46 21.64,6.46 C6.1 ; 22.22,6.46 23.37,6.46 C5.1
12V: length 98.4
  Top Layer w0.381: 27.05,30.47 27.96,30.47 31,27.42 32.25,27.42 12vPullup.1 32.26,18.29 v1(32.64,17.91) ; 27.05,30.47 24.76,32.76 24.76,33.52 ; 27.05,30.47 25.53,28.95 25.53,16.37 ; 24.76,33.52 23.39,32.15 ; 24.76,33.52 25.91,34.66 25.91,36.95 27.05,38.09 28.19,38.09 28.96,38.85 28.96,40 33.15,44.19 R10.2 38.24,47.75 IC1.9 ; IC2.1 17.27,6.55
  Top Layer w1.016: D1.2 22.63,15.68 25.18,15.68 25.57,16.07 25.57,25.61 25.55,25.63 25.55,28.49 23.39,30.65 Q1.3
  Bottom Layer w0.381: v1(32.64,17.91) SpeedPulser.1
GND: length 149.3
  Top Layer w0.381: J2.4 44.73,5.55 44.73,11.02 47.4,13.69 ; 39.48,13.99 42.91,17.42 43.67,17.42 ; 39.48,13.99 SpeedPulser.3 36.32,17.14 31.5,17.14 v1(30.73,16.38) ; 39.48,13.99 OK1.2 ; 23.88,5.33 24.26,5.33 25.02,6.1 25.02,6.86 29.59,11.43 32.26,11.43 32.64,11.81 32.64,13.33 31.12,14.86 31.12,16 v1(30.73,16.38) ; 23.88,5.33 23.88,4.97 C5.2 ; 23.88,5.33 21.91,5.33 C6.2 17.4,5.02 C4.2 ; 43.67,17.42 47.4,13.69 ; 43.67,17.42 43.83,17.42 R8.1 44.7,19.81 46.23,21.34 46.59,21.34 U2.2 48.83,21.46 C1.2 ; 47.4,13.69 C2.1 49.88,13.69 C3.1 52.39,13.4 U1.29 ; R16.1 30.09,16.38 v1(30.73,16.38) ; IC1.8 45.97,49.28 37.21,49.28 28.45,40.51 26.92,40.51 24.64,38.23 R15.1 ; 24.64,37.08 22.94,37.08 Q2.2 22.88,36.64 20.21,33.97 20.21,21.24 IC2.2 19.81,17.41 v1(21.33,15.89)
  Top Layer w1.016: IC2.2 17.63,18.66 J1.2
  Bottom Layer w0.381: v1(30.73,16.38) 29.97,16.38 U1.14 25.64,15.89 v1(21.33,15.89)
CHASSIS_CANH: length 33.5
  Top Layer w0.381: v1(39.12,21.46) U2.7
  Bottom Layer w0.381: J1.4 9.88,22.9 35.65,22.9 R_TERM.1 38.48,20.83 v1(39.12,21.46)
CHASSIS_CANL: length 37.6
  Top Layer w0.381: v1(33.56,20.46) 34.32,21.22 ; 34.32,21.22 R9.1 ; 34.32,21.22 33.94,21.6 33.94,23.12 35.85,25.03 38.13,25.03 40.43,22.73 U2.6
  Bottom Layer w0.381: J1.3 9.83,20.46 v1(33.56,20.46)
CHASSIS_RX: length 7.3
  Top Layer w0.381: U1.24 50.29,24 U2.4
CHASSIS_TX: length 8.1
  Top Layer w0.381: U1.25 52.81,23.98 52.81,23.62 49.38,20.19 U2.1
DOWN_PAD: length 35.1
  Top Layer w0.381: v1(28.7,36.83) 29.83,36.83 R5.2
  Bottom Layer w0.381: v1(28.7,36.83) U1.5 19.72,36.83 10.31,27.43 8.41,27.43 7.64,26.66 7.64,20.19 J1.11
EML: length 38.9
  Top Layer w0.381: R4.1 37.84,35.05 IC1.14 ; v1(13.21,26.29) 9.12,30.38 J1.7
  Bottom Layer w0.381: v1(13.21,26.29) 17.4,30.48 30.73,30.48 32.26,32 36.83,32 IC1.14
EPC: length 41
  Top Layer w0.381: R3.1 37.85,32.51 IC1.15
  Bottom Layer w0.381: IC1.15 41.4,34.04 41.4,35.56 40.64,36.32 30.35,36.32 28.45,38.23 20.07,38.23 15.5,33.66 J1.8
ESP_EML: length 6.2
  Bottom Layer w0.381: U1.20 51.18,35.05 IC1.3
ESP_EPC: length 6.2
  Bottom Layer w0.381: U1.21 51.18,32.51 IC1.2
ESP_MK2RPM: length 6.2
  Bottom Layer w0.381: IC1.1 51.18,29.97 U1.22
ESP_REVERSE: length 29.9
  Bottom Layer w0.381: U1.9 28.32,25.91 33.4,25.91 38.74,31.24 40.64,31.24 42.16,32.77 42.16,37.34 IC1.6
ESP_RPM: length 9.1
  Bottom Layer w0.381: IC1.4 51.69,41.78 51.69,43.18 U1.17
ESP_SPEED: length 9.1
  Bottom Layer w0.381: IC1.5 51.69,44.32 51.69,45.72 U1.16
ESP_SPEEDPULSE: length 18
  Top Layer w0.381: OK1.3 29.97,13.48 R16.2 28.83,16.14 28.83,27.94 U1.8
GPS_RX: length 18.1
  Top Layer w0.381: v1(29.1,11.92) 29.1,14.97 U1.13
  Bottom Layer w0.381: J2.2 31.92,11.92 v1(29.1,11.92)
GPS_TX: length 26.7
  Bottom Layer w0.381: U1.11 33.66,21.59 42.27,12.97 42.27,5.59 J2.3
MK2RPM: length 36.9
  Top Layer w0.381: J1.18 6.5,36.16 8.79,38.45 10.31,38.45 ; 10.31,38.45 10.31,48.35 12.57,50.62 L1.1 ; 10.31,38.45 11.45,37.31 14.88,37.31 17.26,34.93 19.93,34.93 20.81,35.8 Q2.3
N$1: length 4.2
  Top Layer w0.381: L1.2 18.67,36.1 D2.2
N$5: length 2.8
  Top Layer w0.381: U2.8 41.29,20.19 43.2,18.29
N$8: length 2.9
  Top Layer w0.381: R9.2 35.7,23.37 R_TERM.2
N$13: length 3
  Top Layer w0.381: OK1.1 41.9,10.03 R17.1
N$14: length 11.7
  Top Layer w0.381: SpeedPulser.2 35.18,14.22 38.23,11.18 43.05,11.18 R12.2
PWR_IN: length 34.7
  Top Layer w0.381: 9.12,15.86 J1.1 7.6,17.69 7.6,36.36 8.74,37.5 10.26,37.5 11.69,36.07 D2.1
  Top Layer w1.016: J1.1 13.46,11.82 D1.1
REVERSE: length 10.1
  Top Layer w1.016: J1.9 10.09,36.16 Q1.2
RPM: length 43.9
  Top Layer w0.381: R6.1 37.87,37.59 IC1.13 ; v1(15.11,40.26) v1(12.83,37.97)
  Bottom Layer w0.381: v1(12.83,37.97) 9.78,34.93 8.74,34.93 7.98,34.16 7.98,29.81 J1.6 ; v1(15.11,40.26) 15.49,40.64 36.83,40.64 IC1.13
SPEED: length 40.2
  Top Layer w0.381: IC1.12 R7.1 36.69,41.28 35.93,41.28 35.17,40.51 35.17,35.94 v1(33.27,34.04)
  Bottom Layer w0.381: J1.5 12.06,26.16 18.79,32.89 32.12,32.89 v1(33.27,34.04)
SPEEDPULSE: length 45.4
  Top Layer w0.381: v1(41.26,11.93) R17.2 43.81,11.93 43.81,11.92
  Bottom Layer w0.381: v1(41.26,11.93) 40.5,12.69 10.78,12.69 7.64,15.83 7.64,16.59 6.88,17.35 5.74,17.35 4.98,18.11 4.98,20.02 J1.12
ULNMK2: length 3.7
  Top Layer w0.381: R13.1 R1.1 IC1.16
ULNREVERSE: length 2
  Top Layer w0.381: IC1.11 37.91,42.67 R11.1
UP_PAD: length 48.1
  Top Layer w0.381: v1(29.46,38.23) 29.85,38.62 R2.2
  Bottom Layer w0.381: J1.10 4.22,18.07 4.22,28.74 5.36,29.88 6.5,29.88 7.26,30.64 7.26,36.36 10.28,39.37 U1.4 28.32,39.37 v1(29.46,38.23)
$1N6167: length 26
  Top Layer w0.381: R13.2 33.55,25.54 v1(33.55,25.27) ; v1(22.88,29.02) 21.35,30.55 21.35,33.59 Q2.1 24.44,35.12 R15.2
  Bottom Layer w0.381: v1(33.55,25.27) 25.93,25.27 22.88,28.32 v1(22.88,29.02)
$1N7551: length 25.2
  Top Layer w0.381: v1(23.77,28.56) 23.39,28.18 Q1.1 ; v1(29.87,29.7) 29.87,31.61 34.29,36.03 34.29,42.3 R10.1 36.37,42.68 R11.2
  Bottom Layer w0.381: v1(29.87,29.7) 27.96,27.8 24.54,27.8 v1(23.77,28.56)
$1N9668: length 14.2
  Top Layer w0.381: R1.2 12vPullup.2 ; R6.2 36.32,40.12 R7.2 ; 36.33,35.04 R3.2 36.33,29.97 ; R4.2 36.32,37.63

## Copper pours and planes (outline as drawn; the poured copper is in the pictures)
GND on Bottom Layer: 0,53.65 55.36,53.65 55.36,0 0,0

## Text on the board
Top Silkscreen Layer: Forbes Automotive, '25 | GPS | CAN2Cluster V2
